# Altium schematic sheet interface.SchDoc
size A4
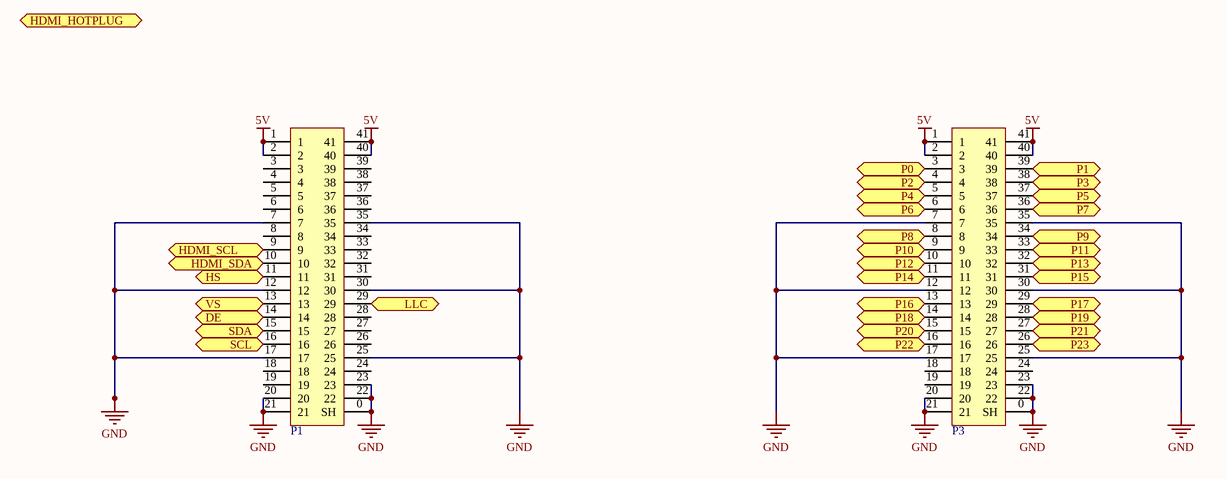
[diagram p0: interface.SchDoc]

## Parts
P1  DF9-41S  [DF9-41S]  (value not drawn)
P3  DF9-41S  [DF9-41S]  (value not drawn)

## Ports
DE, HDMI_HOTPLUG, HDMI_SCL, HDMI_SDA, HS, LLC, P0, P1, P2, P3, P4, P5, P6, P7, P8, P9, P10, P11, P12, P13, P14, P15, P16, P17, P18, P19, P20, P21, P22, P23, SCL, SDA, VS

## Nets
5V: P1.1 P1.2 P1.40 P1.41 P3.1 P3.2 P3.40 P3.41
GND: P1.0(SH) P1.7 P1.12 P1.17 P1.20 P1.21 P1.22 P1.23 P1.25 P1.30 P1.35 P3.0(SH) P3.7 P3.12 P3.17 P3.20 P3.21 P3.22 P3.23 P3.25 P3.30 P3.35
DE: P1.14 ; port DE
HDMI_SCL: P1.9 ; port HDMI_SCL
HDMI_SDA: P1.10 ; port HDMI_SDA
HS: P1.11 ; port HS
LLC: P1.29 ; port LLC
P0: P3.3 ; port P0
P1: P3.39 ; port P1
P2: P3.4 ; port P2
P3: P3.38 ; port P3
P4: P3.5 ; port P4
P5: P3.37 ; port P5
P6: P3.6 ; port P6
P7: P3.36 ; port P7
P8: P3.8 ; port P8
P9: P3.34 ; port P9
P10: P3.9 ; port P10
P11: P3.33 ; port P11
P12: P3.10 ; port P12
P13: P3.32 ; port P13
P14: P3.11 ; port P14
P15: P3.31 ; port P15
P16: P3.13 ; port P16
P17: P3.29 ; port P17
P18: P3.14 ; port P18
P19: P3.28 ; port P19
P20: P3.15 ; port P20
P21: P3.27 ; port P21
P22: P3.16 ; port P22
P23: P3.26 ; port P23
SCL: P1.16 ; port SCL
SDA: P1.15 ; port SDA
VS: P1.13 ; port VS

Not connected (* = marked no-connect by the designer): P1 3 4 5 6 8 18 19 24 26 27 28 31 32 33 34 36 37 38 39; P3 18 19 24